# Altium schematic sheet Control_Module_PSU.SchDoc: Módulo de Control - Power Supply
size A4; Author: Martin C.A. Yunis; CompanyName: Sistema de Control de Acceso; Revision: V1; SheetNumber: 5; SheetTotal: 7
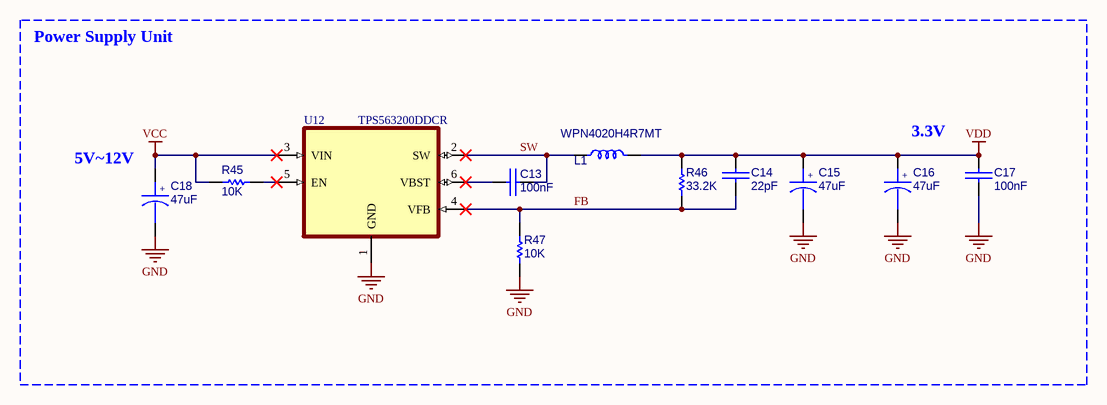
[diagram p0: Control_Module_PSU.SchDoc]

## Parts
C13  100nF  [CAP0402]
C14  22pF  [CAP0402]
C15  47uF  [CAP_P1210]
C16  47uF  [CAP_P1210]
C17  100nF  [CAP0402]
C18  47uF  [CAP_P1210]
L1  WPN4020H4R7MT  [ind1515]
R45  10K  [RES0402]
R46  33.2K  [RES0402]
R47  10K  [RES0402]
U12  TPS563200DDCR  [SOT95P280X110-6N]

## Nets
GND: C15.2 C16.2 C17.2 C18.2 R47.2 U12.1(GND)
VCC: C18.1 R45.1 U12.3(VIN)
VDD: C14.2 C15.1 C16.1 C17.1 L1.2 R46.2
FB: C14.1 R46.1 R47.1 U12.4(VFB)
SW: C13.2 L1.1 U12.2(SW)
NetC13_1: C13.1 U12.6(VBST)
NetR45_2: R45.2 U12.5(EN)

## Notes on the sheet
- Power Supply Unit
- (near C18) 5V~12V
- 3.3V
- Title:
- Size:
- Author:
- A4
- Sheet
- of
- Revision:
- File:
- Date:
- (in symbol CAP_P) +

## Library data of the parts
C13 C17 = CAP: Non Polarized Capacitor; MANUF P/N: CL05B104KO5NNNC; JLCPCB P/N: C1525
C14 = CAP: Non Polarized Capacitor; MANUF P/N: CL05C220JB5NNNC; JLCPCB P/N: C70464
C15 C16 C18 = CAP_P: Polarized Capacitor; MANUF P/N: TCNT476M016R0150; JLCPCB P/N: C5348293
L1 = IND: Inductor / FP-IFSC1515AH-MFG; MANUF P/N: WPN4020H4R7MT; JLCPCB P/N: C98363
R45 R47 = Res1: Resistor; MANUF P/N: CRCW040210K0FKED; JLCPCB P/N: C71617
R46 = Res1: Resistor; MANUF P/N: RC0402FR-0733K2L; JLCPCB P/N: C130276
U12 = TPS563200DDCR: 17 V Input, 3A Synchronous Step-Down Regulator in SOT-23 with Advanced Eco-modeâ„¢; MF: Texas Instruments; SnapEDA_Link: https://www.snapeda.com/parts/TPS563200DDCR/Texas+Instruments/view-part/?ref=snap; Package: SOT-23-THN-6 Texas Instruments; Value: *; MP: TPS563200DDCR; Check_prices: https://www.snapeda.com/parts/TPS563200DDCR/Texas+Instruments/view-part/?ref=eda; MANUF P/N: TPS563200DDCR; JLCPCB P/N: C97253